# EAGLE design TDC1000_Front_End (EAGLE 9.3.0)
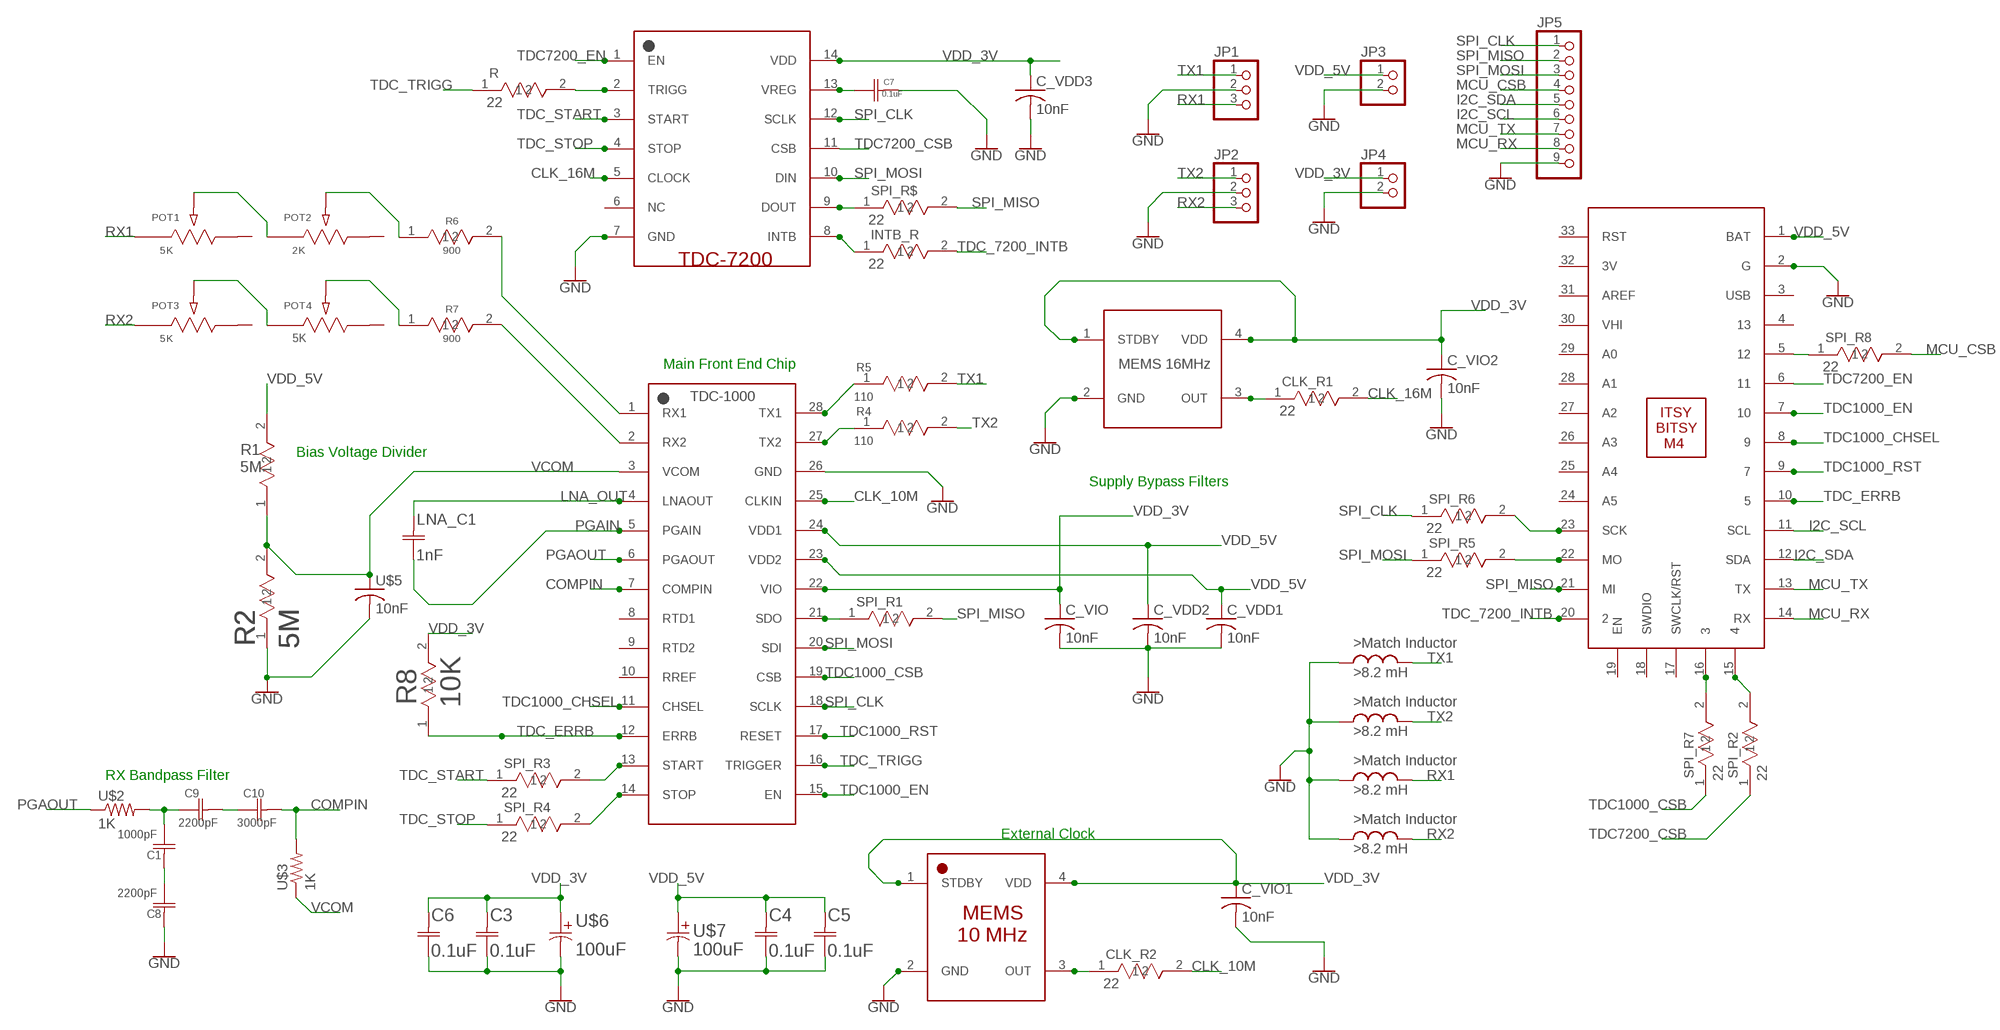
[diagram p0: schematic, sheet 1]

## Parts
C1  1000pF  06035C104JAT2A  [0603]
C3  0.1uF  06035C104JAT2A  [0603]
C4  0.1uF  06035C104JAT2A  [0603]
C5  0.1uF  06035C104JAT2A  [0603]
C6  0.1uF  06035C104JAT2A  [0603]
C7  0.1uF  06035C104JAT2A  [0603]
C8  2200pF  06035C104JAT2A  [0603]
C9  2200pF  06035C104JAT2A  [0603]
C10  3000pF  06035C104JAT2A  [0603]
C_VDD1  10nF  CL05B103KB5NNNC  [CL05B103KB5NNNC]
C_VDD2  10nF  CL05B103KB5NNNC  [CL05B103KB5NNNC]
C_VDD3  10nF  CL05B103KB5NNNC  [CL05B103KB5NNNC]
C_VIO  10nF  CL05B103KB5NNNC  [CL05B103KB5NNNC]
C_VIO1  10nF  CL05B103KB5NNNC  [CL05B103KB5NNNC]
C_VIO2  10nF  CL05B103KB5NNNC  [CL05B103KB5NNNC]
CLK_R1  22  MMB02070C2209FB200  [MMB0207]
CLK_R2  22  MMB02070C2209FB200  [MMB0207]
INTB_R  22  MMB02070C2209FB200  [MMB0207]
JP1  PINHD-1X3/90  [1X03/90]
JP2  PINHD-1X3/90  [1X03/90]
JP3  PINHD-1X2/90  [1X02/90]
JP4  PINHD-1X2/90  [1X02/90]
JP5  PINHD-1X9  [1X09]
LNA_C1  1nF  06035C104JAT2A  [0603]
POT1  5K  3362P-1-502LF  [POT_3362P]
POT2  2K  3362P-1-502LF  [POT_3362P]
POT3  5K  3362P-1-502LF  [POT_3362P]
POT4  5K  3362P-1-502LF  [POT_3362P]
R  22  MMB02070C2209FB200  [MMB0207]
R1  5M  PAT1206E9000BST1  [1206]
R2  5M  PAT1206E9000BST1  [1206]
R4  110  RR1220P-111-D  [RES_1220]
R5  110  RR1220P-111-D  [RES_1220]
R6  900  PAT1206E9000BST1  [1206]
R7  900  PAT1206E9000BST1  [1206]
R8  10K  RR0816P-103-D  [RES_0816]
SPI_R1  22  MMB02070C2209FB200  [MMB0207]
SPI_R2  22  MMB02070C2209FB200  [MMB0207]
SPI_R3  22  MMB02070C2209FB200  [MMB0207]
SPI_R4  22  MMB02070C2209FB200  [MMB0207]
SPI_R5  22  MMB02070C2209FB200  [MMB0207]
SPI_R6  22  MMB02070C2209FB200  [MMB0207]
SPI_R7  22  MMB02070C2209FB200  [MMB0207]
SPI_R8  22  MMB02070C2209FB200  [MMB0207]
SPI_R$  22  MMB02070C2209FB200  [MMB0207]
U$1  TDC1000_TSSOP  [TDC1000_TSSOP]
U$2  1K  ESR03_1K_RESISTOR  [ROHM_ESR03]
U$3  1K  ESR03_1K_RESISTOR  [ROHM_ESR03]
U$4  DSC1001CL5-010.0000_2.5X10MHZ_2.5X3.2MM  [DSC1001CL5-010.0000_2.5X3.2MM]
U$5  10nF  CL05B103KB5NNNC  [CL05B103KB5NNNC]
U$6  100uF  UKL1E101KPDANATA_100UF_CAP  [UKL1E101KPDANATA_100UF]
U$7  100uF  UKL1E101KPDANATA_100UF_CAP  [UKL1E101KPDANATA_100UF]
U$8  TDC7200_TSSOPTSSOP-14  [TDC7200_TSSOP]
U$9  DSC1001BL5-016.0000_5X3.2MM  [DSC1001BL5-016.0000_5X3.2MM]
U$10  ITSY_BITSY_M4  [ITSY_BITSY_M4]
U$11  AIUR_16_8.2MH_INDUCTOR  [AIUR-16_8MH_INDUCTOR]
U$12  AIUR_16_8.2MH_INDUCTOR  [AIUR-16_8MH_INDUCTOR]
U$13  AIUR_16_8.2MH_INDUCTOR  [AIUR-16_8MH_INDUCTOR]
U$14  AIUR_16_8.2MH_INDUCTOR  [AIUR-16_8MH_INDUCTOR]

## Nets
CLK_10M: CLK_R2.2 U$1.25(CLKIN)
CLK_16M: CLK_R1.2 U$8.5(CLOCK)
COMPIN: C10.2 U$1.7(COMPIN) U$3.P$2
GND: C3.1 C4.1 C5.1 C6.1 C7.2 C8.2 C_VDD1.2 C_VDD2.2 C_VDD3.2 C_VIO1.2 C_VIO2.2 C_VIO.2 JP1.2 JP2.2 JP3.2 JP4.2 JP5.9 R2.1 U$1.26(GND) U$4.2(GND) U$5.2 U$6.1 U$7.1 U$8.7(GND) U$9.2(GND) U$10.2(G) U$11.1 U$12.1 U$13.1 U$14.1
I2C_SCL: JP5.6 U$10.11(SCL)
I2C_SDA: JP5.5 U$10.12(SDA)
LNA_OUT: LNA_C1.2 U$1.4(LNAOUT)
MCU_CSB: JP5.4 SPI_R8.2
MCU_RX: JP5.8 U$10.14(RX)
MCU_TX: JP5.7 U$10.13(TX)
N$1: SPI_R1.1 U$1.21(SDO)
N$2: SPI_R2.2 U$10.15
N$3: R.2 U$8.2(TRIGG)
N$4: SPI_R3.2 U$1.13(START)
N$5: SPI_R8.1 U$10.5
N$6: CLK_R2.1 U$4.3(OUT)
N$8: C1.1 C9.1 U$2.P$2
N$9: R5.1 U$1.28(TX1)
N$10: C9.2 C10.1
N$11: R4.1 U$1.27(TX2)
N$12: SPI_R4.2 U$1.14(STOP)
N$13: SPI_R$.1 U$8.9(DOUT)
N$14: INTB_R.1 U$8.8(INTB)
N$15: SPI_R6.2 U$10.23(SCK)
N$16: SPI_R5.2 U$10.22(MO)
N$17: CLK_R1.1 U$9.3(OUT)
N$18: C7.1 U$8.13(VREG)
N$19: SPI_R7.2 U$10.16
N$20: POT4.2 R7.1
N$21: POT3.2 POT4.1
N$22: R7.2 U$1.2(RX2)
N$23: R6.2 U$1.1(RX1)
N$24: POT1.2 POT2.1
N$25: POT2.2 R6.1
N$26: C1.2 C8.1
PGAIN: LNA_C1.1 U$1.5(PGAIN)
PGAOUT: U$1.6(PGAOUT) U$2.P$1
RX1: JP1.3 POT1.1 U$14.2
RX2: JP2.3 POT3.1 U$13.2
SPI_CLK: JP5.1 SPI_R6.1 U$1.18(SCLK) U$8.12(SCLK)
SPI_MISO: JP5.2 SPI_R1.2 SPI_R$.2 U$10.21(MI)
SPI_MOSI: JP5.3 SPI_R5.1 U$1.20(SDI) U$8.10(DIN)
TDC1000_CHSEL: U$1.11(CHSEL) U$10.8
TDC1000_CSB: SPI_R7.1 U$1.19(CSB)
TDC1000_EN: U$1.15(EN) U$10.7
TDC1000_RST: U$1.17(RESET) U$10.9
TDC7200_CSB: SPI_R2.1 U$8.11(CSB)
TDC7200_EN: U$8.1(EN) U$10.6
TDC_7200_INTB: INTB_R.2 U$10.20
TDC_ERRB: R8.1 U$1.12(ERRB) U$10.10
TDC_START: SPI_R3.1 U$8.3(START)
TDC_STOP: SPI_R4.1 U$8.4(STOP)
TDC_TRIGG: R.1 U$1.16(TRIGGER)
TX1: JP1.1 R5.2 U$12.2
TX2: JP2.1 R4.2 U$11.2
VCOM: R1.1 R2.2 U$1.3(VCOM) U$3.P$1 U$5.1
VDD_3V: C3.2 C6.2 C_VDD3.1 C_VIO1.1 C_VIO2.1 C_VIO.1 JP4.1 R8.2 U$1.22(VIO) U$4.1(STDBY) U$4.4(VDD) U$6.2 U$8.14(VDD) U$9.1(STDBY) U$9.4(VDD)
VDD_5V: C4.2 C5.2 C_VDD1.1 C_VDD2.1 JP3.1 R1.2 U$1.23(VDD2) U$1.24(VDD1) U$7.2 U$10.1(BAT)
Unconnected: POT1.3 POT2.3 POT3.3 POT4.3 U$1.8(RTD1) U$1.9(RTD2) U$1.10(RREF) U$8.6(NC) U$10.3(USB) U$10.4 U$10.17(SWCLK/RST) U$10.18(SWDIO) U$10.19(EN) U$10.24(A5) U$10.25(A4) U$10.26(A3) U$10.27(A2) U$10.28(A1) U$10.29(A0) U$10.30(VHI) U$10.31(AREF) U$10.32(3V) U$10.33(RST)

## Notes on the sheet
- Main Front End Chip
- Bias Voltage Divider
- Supply Bypass Filters
- RX Bandpass Filter
- External Clock

## Library data of the parts
C1 C3-C10 LNA_C1 = Ultrasonic Misc PieceParts:06035C104JAT2A; MANUFACTURER_PART_NUMBER: 06035C104JAT2A; VENDOR: AVX Corporation
C_VDD1-C_VDD3 C_VIO C_VIO1 C_VIO2 U$5 = Ultrasonic Misc PieceParts:CL05B103KB5NNNC
CLK_R1 CLK_R2 INTB_R R SPI_R1-SPI_R8 SPI_R$ = Ultrasonic Misc PieceParts:MMB02070C2209FB200; MANUFACTURER_PART_NUMBER: MMB02070C2209FB200; VENDOR: Vishay
JP1 JP2 = pinhead:PINHD-1X3: PIN HEADER
JP3 JP4 = pinhead:PINHD-1X2: PIN HEADER
JP5 = pinhead:PINHD-1X9: PIN HEADER
POT1-POT4 = Ultrasonic Misc PieceParts:3362P-1-502LF; MANUFACTURER_PART_NUMBER: 3362P1502LF; VENDOR: Bourns Electronics
R1 R2 R6 R7 = Ultrasonic Misc PieceParts:PAT1206E9000BST1; MANUFACTURER_PART_NUMBER: PAT1206E9000BST1; VENDOR: Vishay
R4 R5 = Ultrasonic Misc PieceParts:RR1220P-111-D; MANUFACTURER_PART_NUMBER: RR1220P111D; VENDOR: Susumu
R8 = Ultrasonic Misc PieceParts:RR0816P-103-D; MANUFACTURER_PART_NUMBER: RR0816P103D; VENDOR: Susumu
U$1 = Texas Instruments:TDC1000_TSSOP
U$2 U$3 = Ultrasonic Misc PieceParts:ESR03_1K_RESISTOR
U$4 = MicroChip Technology:DSC1001CL5-010.0000_2.5X
U$6 U$7 = Ultrasonic Misc PieceParts:UKL1E101KPDANATA_100UF_CAP
U$8 = Texas Instruments:TDC7200_TSSOP
U$9 = MicroChip Technology:DSC1001BL5-016.0000_5X3.2MM: A 16MHz MEMS Oscillator (5x3.2mm) by MicroChip Technology
U$10 = Adafruit_Arduino:ITSY_BITSY_M4
U$11-U$14 = Ultrasonic Misc PieceParts:AIUR_16_8.2MH_INDUCTOR

## Board
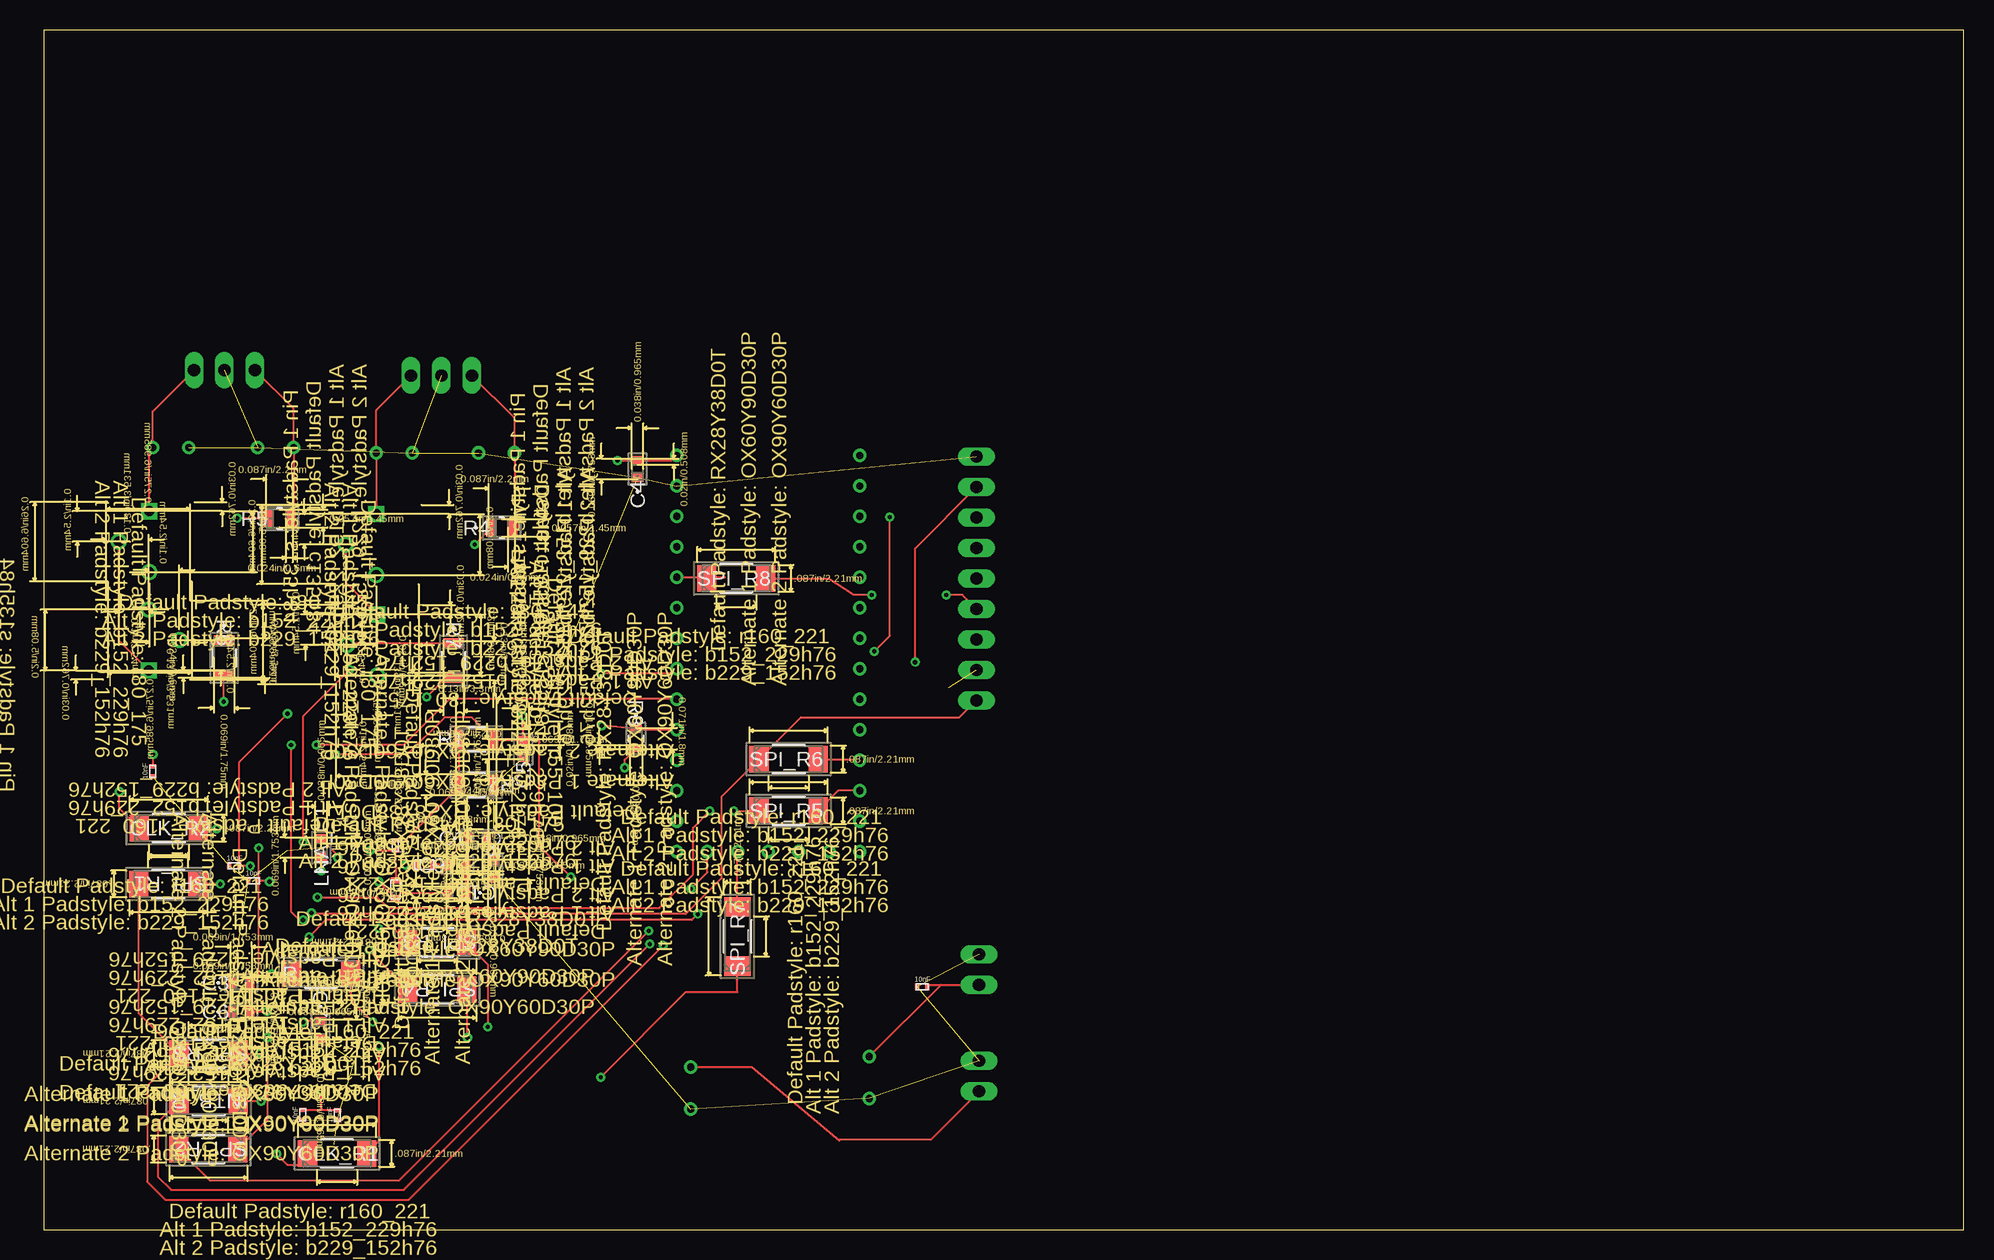
[diagram p1: board, top side]
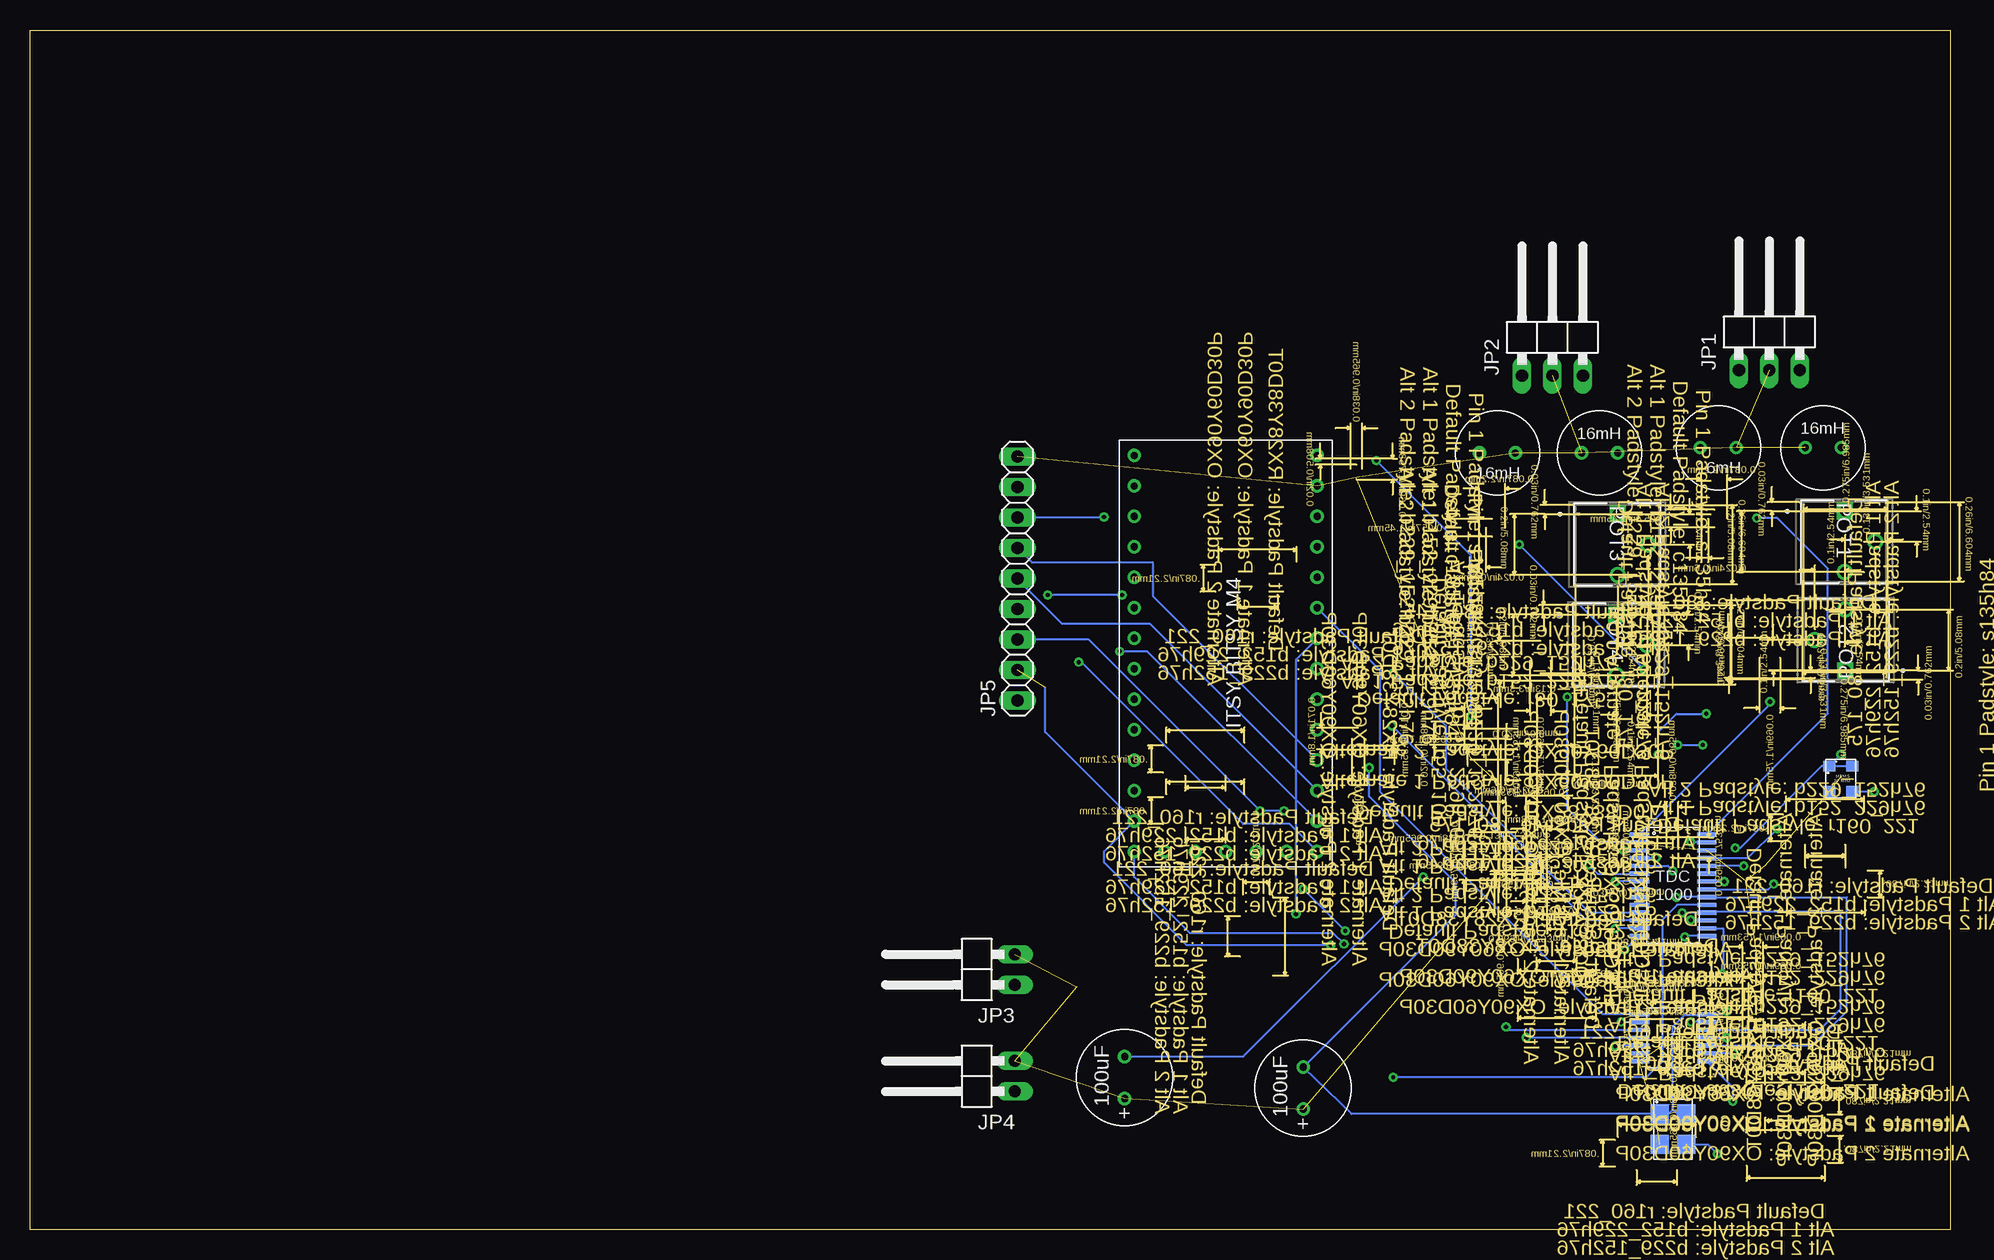
[diagram p2: board, bottom side, seen from below]

Size 160 x 100 mm. Coordinates in mm from the lower left corner, seen from the top.
Outline: 0,0 160,0 160,100 0,100 0,0
Copper layers (1*16): Top 0.035mm / dielectric 1.5mm / Bottom 0.035mm
Design rules "default": minimum track width 6mil, minimum drill 0.35mm, track to track 6mil, track to pad 6mil, pad to pad 6mil, via to via 6mil, smd to smd 6mil, copper to edge 40mil, drill to drill 6mil, minimum pad ring 10mil, minimum via ring 8mil, stop-mask expansion 4mil, vias tented up to drill 0mil, thermal gap 10mil

### Footprints (pad centres in the part's own frame; a part is rotated, then mirrored left to right if it is on the bottom)
0603 = smd 0.711 x 0.965: 1 -0.724,0; 2 0.724,0
CL05B103KB5NNNC = smd 0.33 x 0.6: 1 -0.415,0; 2 0.415,0
MMB0207 = smd 1.6 x 2.21: 1 -2.464,0; 2 2.464,0
1X03/90 = drill 1.016 long: 1 -2.54,-3.81; 2 0,-3.81; 3 2.54,-3.81
1X02/90 = drill 1.016 long: 1 -1.27,-3.81; 2 1.27,-3.81
1X09 = drill 1.016 long: 1 -10.16,0; 2 -7.62,0; 3 -5.08,0; 4 -2.54,0; 5 0,0; 6 2.54,0; 7 5.08,0; 8 7.62,0; 9 10.16,0
POT_3362P = drill 0.838 pad 1.346 square: 1 -5.08,0.076 | drill 0.838 pad 1.346: 2 -2.54,2.616; 3 0,0.076
1206 = smd 0.803 x 1.75: 1 -1.452,0; 2 1.452,0
RES_1220 = smd 0.803 x 1.45: 1 -0.902,0; 2 0.902,0
RES_0816 = smd 0.553 x 1: 1 -0.827,0; 2 0.827,0
TDC1000_TSSOP = smd 1.6 x 0.35: 1 -2.8,4.225; 2 -2.8,3.575; 3 -2.8,2.925; 4 -2.8,2.275; 5 -2.8,1.625; 6 -2.8,0.975; 7 -2.8,0.325; 8 -2.8,-0.325; 9 -2.8,-0.975; 10 -2.8,-1.625; 11 -2.8,-2.275; 12 -2.8,-2.925; 13 -2.8,-3.575; 14 -2.8,-4.225; 15 2.8,-4.225; 16 2.8,-3.575; 17 2.8,-2.925; 18 2.8,-2.275; 19 2.8,-1.625; 20 2.8,-0.975; 21 2.8,-0.325; 22 2.8,0.325; 23 2.8,0.975; 24 2.8,1.625; 25 2.8,2.275; 26 2.8,2.925; 27 2.8,3.575; 28 2.8,4.225
ROHM_ESR03 = smd 0.5 x 0.8: P$1 -0.75,0; P$2 0.75,0
DSC1001CL5-010.0000_2.5X3.2MM = smd 1 x 0.9: 1 -0.95,1.05; 2 -0.95,-1.05; 3 0.95,-1.05; 4 0.95,1.05
UKL1E101KPDANATA_100UF = drill 0.6: 1 -1.75,0; 2 1.75,0
TDC7200_TSSOP = smd 1.6 x 0.35: 1 -2.8,1.95; 2 -2.8,1.3; 3 -2.8,0.65; 4 -2.8,0; 5 -2.8,-0.65; 6 -2.8,-1.3; 7 -2.8,-1.95; 8 2.8,-1.95; 9 2.8,-1.3; 10 2.8,-0.65; 11 2.8,0; 12 2.8,0.65; 13 2.8,1.3; 14 2.8,1.95
DSC1001BL5-016.0000_5X3.2MM = smd 1.5 x 1.6: 1 -1.1,1.27; 2 -1.1,-1.27; 3 1.1,-1.27; 4 1.1,1.27
ITSY_BITSY_M4 = drill 0.6: 1 -16.51,7.62; 2 -13.97,7.62; 3 -11.43,7.62; 4 -8.89,7.62; 5 -6.35,7.62; 6 -3.81,7.62; 7 -1.27,7.62; 8 1.27,7.62; 9 3.81,7.62; 10 6.35,7.62; 11 8.89,7.62; 12 11.43,7.62; 13 13.97,7.62; 14 16.51,7.62; 15 16.51,5.08; 16 16.51,2.54; 17 16.51,0; 18 16.51,-2.54; 19 16.51,-5.08; 20 16.51,-7.62; 21 13.97,-7.62; 22 11.43,-7.62; 23 8.89,-7.62; 24 6.35,-7.62; 25 3.81,-7.62; 26 1.27,-7.62; 27 -1.27,-7.62; 28 -3.81,-7.62; 29 -6.35,-7.62; 30 -8.89,-7.62; 31 -11.43,-7.62; 32 -13.97,-7.62; 33 -16.51,-7.62
AIUR-16_8MH_INDUCTOR = drill 0.6: 1 -1.5,0; 2 1.5,0

### Placement (x,y rotation side)
C1  36.16,32.63 0 top
C3  16.44,20.56 0 top
C4  49.47,63.4 90 top
C5  39.95,40.05 90 top
C6  16.44,18.16 0 top
C7  23.05,16.66 270 top
C8  37.48,30 270 top
C9  34.45,30.37 0 top
C10  34.43,28.07 180 top
C_VDD1  73.18,20.24 180 top
C_VDD2  15.86,30.33 180 top
C_VDD3  21.58,9.57 270 top
C_VIO  9.07,38.19 270 top
C_VIO1  17.44,29.08 180 top
C_VIO2  24.46,9.53 270 top
CLK_R1  24.43,6.35 0 top
CLK_R2  10.41,33.47 0 top
INTB_R  13.73,10.71 180 top
JP1  15.05,75.45 0 bottom
JP2  33.13,75.01 0 bottom
JP3  81.74,21.67 90 bottom
JP4  81.74,12.78 90 bottom
JP5  77.71,54.27 90 bottom
LNA_C1  23.11,31.84 90 top
POT1  8.85,54.8 270 bottom
POT2  8.65,51.68 90 bottom
POT3  27.77,54.56 270 bottom
POT4  27.87,46.2 270 bottom
R  23.1,21.32 0 top
R1  36.03,40.88 0 top
R2  36.03,37.07 180 top
R4  38.16,58.5 0 top
R5  19.64,59.27 0 top
R6  15.02,47.65 270 top
R7  34.14,47.43 270 top
R8  49.34,40.93 270 top
SPI_R1  10.37,28.81 180 top
SPI_R2  13.7,6.7 180 top
SPI_R3  32.78,23.94 180 top
SPI_R4  32.78,20.02 180 top
SPI_R5  62.06,34.91 0 top
SPI_R6  62.06,39.22 0 top
SPI_R7  57.79,24.43 90 top
SPI_R8  57.7,54.29 0 top
SPI_R$  13.73,14.65 180 top
U$1  23.08,28.69 0 bottom
U$2  31.7,30.42 0 top
U$3  29.31,28.35 270 top
U$4  9.11,37.58 0 bottom
U$5  29.3,32.03 90 top
U$6  53.9,11.79 90 bottom
U$7  68.78,12.67 90 bottom
U$8  23.08,15.99 0 bottom
U$9  23.08,8.37 0 bottom
U$10  60.36,48.02 270 bottom
U$11  37.72,64.74 180 bottom
U$12  19.31,65.18 180 bottom
U$13  29.2,64.74 0 bottom
U$14  10.57,65.18 0 bottom

### Tracks (layer width: path | path; a pad name or v marks a point on that pad's centre or on a via)
CLK_10M  (via drill 0.35)
  Top 0.152: v14.4,33.4 14.33,33.47 CLK_R2.2
  Bottom 0.152: U$1.25 16.84,30.96 v14.4,33.4
CLK_16M  (via drill 0.35)
  Top 0.152: v27.9,15.3 27.9,7.36 CLK_R1.2
  Bottom 0.152: U$8.5 25.92,15.3 v27.9,15.3
COMPIN  (via drill 0.35)
  Top 0.152: C10.2 29.78,28.07 U$3.P$2 v27.91,29 v27.9,29
  Bottom 0.152: U$1.7 27.89,29.02 v27.9,29
GND  (29 unrouted)
I2C_SCL
  Bottom 0.152: U$10.11 66.4,52.79 66.4,55.6 76.5,55.6 JP5.6
I2C_SDA
  Bottom 0.152: U$10.12 66.65,50.5 74,50.5 77.71,54.21 JP5.5
LNA_OUT  (via drill 0.35)
  Top 0.152: LNA_C1.2 24.5,31.17 v24.5,31
  Bottom 0.152: U$1.4 24.54,30.96 v24.5,31
MCU_CSB  (via drill 0.35)
  Top 0.152: SPI_R8.2 65.38,54.29 67.47,52.9 v69,52.9 | JP5.4 76.54,52.9 v75.2,52.9
  Bottom 0.152: v69,52.9 v75.2,52.9
MCU_RX  (via drill 0.35)
  Top 0.152: v72.6,47.3 72.6,56.78 JP5.8
  Bottom 0.152: U$10.14 55.03,33.8 58.9,33.8 72.4,47.3 v72.6,47.3
MCU_TX  (via drill 0.35)
  Top 0.152: v69.2,48.2 70.5,49.5 v70.5,59.4
  Bottom 0.152: U$10.13 66.89,48.2 v69.2,48.2 | v70.5,59.4 70.55,59.35 JP5.7
N$1  (via drill 0.35)
  Top 0.152: v14.7,28.8 v14.69,28.81 SPI_R1.1
  Bottom 0.152: U$1.21 15.13,28.36 v14.7,28.8
N$2  (via drill 0.35)
  Top 0.152: SPI_R2.2 13.84,4.1 29.6,4.1 v50.4,24.9 | v53.9,28.4 55.28,29.78 U$10.15
  Bottom 0.152: v50.4,24.9 v53.9,28.4
N$3  (via drill 0.35)
  Top 0.152: R.2 25.56,19.14 v27.4,17.3
  Bottom 0.152: v27.4,17.3 U$8.2
N$4  (via drill 0.35)
  Top 0.152: SPI_R3.2 29.16,25.1 v27.9,25.1
  Bottom 0.152: U$1.13 27.89,25.11 v27.9,25.1
N$5
  Top 0.152: 53.15,54.37 U$10.5 56.74,54.37 SPI_R8.1
N$6  (via drill 0.35)
  Top 0.152: CLK_R2.1 6.3,35.12 v6.3,36.5
  Bottom 0.152: v6.3,36.5 8.13,36.5 U$4.3
N$8
  Top 0.152: C1.1 33.73,30.92 C9.1 33.68,30.42 U$2.P$2
N$9  (via drill 0.35)
  Top 0.152: v16.1,59.3 18.71,59.3 R5.1
  Bottom 0.152: U$1.28 10.18,43.02 10.18,55.1 14.38,59.3 v16.1,59.3
N$10
  Top 0.152: C9.2 35.17,28.09 C10.1
N$11  (via drill 0.35)
  Top 0.152: v21.6,32.3 21.6,42.8 v25.5,46.7 | v35.9,57.1 37.26,58.46 R4.1
  Bottom 0.152: U$1.27 21.57,32.27 v21.6,32.3 | v25.5,46.7 v35.9,57.1
N$12  (via drill 0.35)
  Top 0.152: SPI_R4.2 27.1,23.24 v27.1,23.3
  Bottom 0.152: v27.1,23.3 25.93,24.46 U$1.14
N$13  (via drill 0.35)
  Top 0.152: SPI_R$.1 17.95,14.65 v18,14.7
  Bottom 0.152: v18,14.7 U$8.9
N$14  (via drill 0.35)
  Top 0.152: INTB_R.1 v18.09,10.71 v18.1,10.7
  Bottom 0.152: U$8.8 18.1,11.86 v18.1,10.7
N$15
  Top 0.152: 65.03,39.22 SPI_R6.2 64.61,39.13 U$10.23
N$16
  Top 0.152: U$10.22 66.2,36.59 SPI_R5.2
N$17  (via drill 0.35)  (1 unrouted)
  Top 0.152: v19.4,6.3 20.3,5.4 21.5,5.4
  Bottom 0.152: U$9.3 20.2,7.1 v19.4,6.3
N$18  (via drill 0.35)
  Top 0.152: C7.1 21.68,17.38 v21.6,17.3
  Bottom 0.152: U$8.13 v21.6,17.3
N$19
  Top 0.152: SPI_R7.2 57.79,31.48 U$10.16
N$20
  Top 0.152: POT4.2 25.39,48.88 R7.1
N$21
  Top 0.152: POT3.2 25.15,53.92 POT4.1
N$22  (via drill 0.35)
  Top 0.152: v31.9,44.4 33.48,45.98 R7.2
  Bottom 0.152: U$1.2 28.93,32.27 29,32.2 31.9,35.1 v31.9,44.4
N$23  (via drill 0.35)
  Top 0.152: v15,44 15,46.18 R6.2
  Bottom 0.152: U$1.1 15,43.8 v15,44
N$24
  Top 0.152: POT2.1 6.23,49.09 POT1.2
N$25
  Top 0.152: R6.1 11.3,49.1 POT2.2
N$26
  Top 0.152: C8.1 37.48,32.04 C1.2
PGAIN  (via drill 0.35)
  Top 0.152: v23.1,29.9 23.1,31.11 LNA_C1.1
  Bottom 0.152: U$1.5 23.52,30.32 v23.1,29.9
PGAOUT  (via drill 0.35)
  Top 0.152: U$2.P$1 30.93,30.4 v30.1,30.4
  Bottom 0.152: v30.1,30.4 29.36,29.66 U$1.6
RX1
  Top 0.152: POT1.1 8.77,64.88 U$14.2 9.07,68.2 JP1.3
RX2
  Top 0.152: JP2.3 27.7,68.31 U$13.2 POT3.1
SPI_CLK  (via drill 0.35)
  Top 0.152: v22.3,26.4 22.4,26.3 53.5,26.3 56.5,29.3 56.5,36.12 SPI_R6.1 63.08,42.7 76.3,42.7 JP5.1
  Bottom 0.152: U$8.12 10.86,16.64 9.1,18.4 9.1,26.4 9.2,26.5 20.2,26.5 U$1.18 | U$1.18 20.3,26.4 | U$1.18 22.29,26.41 v22.3,26.4
SPI_MISO  (via drill 0.35)  (1 unrouted)
  Top 0.152: SPI_R1.2 7.91,18.01 SPI_R$.2 8.6,11.98 8.6,4 10.1,2.5 30.4,2.5 v51.6,23.7
  Bottom 0.152: v51.6,23.7 63.6,23.7 70.5,30.6 70.5,31.53 U$10.21 75.4,41.47 75.4,45.2
SPI_MOSI  (via drill 0.35)
  Top 0.152: v22.8,27.7 27.8,27.7 28.7,26.8 51.3,26.8 54.1,29.6 54.1,33.5 v55.5,34.9 | v57.5,34.9 59.59,34.9 SPI_R5.1
  Bottom 0.152: U$8.10 11.46,15.34 8.6,18.2 8.6,27.7 20.27,27.7 U$1.20 22.79,27.71 v22.8,27.7 | v55.5,34.9 v57.5,34.9 71.79,49.19 JP5.3
TDC1000_CHSEL  (via drill 0.35)
  Top 0.152: v46.4,46.4 52.39,46.4 U$10.8
  Bottom 0.152: U$1.11 30.02,26.41 42,38.4 42,42 v46.4,46.4
TDC1000_CSB  (via drill 0.35)
  Top 0.152: v46.4,12.7 53.5,19.8 57.8,19.8 57.8,21.96 SPI_R7.1
  Bottom 0.152: U$1.19 22.73,27.07 24,25.8 24,14 25.3,12.7 v46.4,12.7
TDC1000_EN  (via drill 0.35)
  Top 0.152: v22.1,24.4 23.5,25.8 54,25.8 v54.5,26.3
  Bottom 0.152: U$1.15 22.04,24.46 v22.1,24.4 | v54.5,26.3 54.5,47.53 U$10.7
TDC1000_RST  (via drill 0.35)
  Top 0.152: U$10.9 33.81,44.21 30,40.4 v22.7,40.4 | v21.6,25.8 21.3,25.8 20.6,26.5 v20.6,40.4
  Bottom 0.152: v22.7,40.4 v20.6,40.4 | U$1.17 21.57,25.77 v21.6,25.8
TDC7200_CSB  (via drill 0.35)
  Top 0.152: v18.6,16 18.6,9.14 SPI_R2.1
  Bottom 0.152: U$8.11 v18.61,15.99 v18.6,16
TDC7200_EN
  Bottom 0.152: U$8.1 28.94,17.94 47.5,36.5 47.5,46.59 U$10.6
TDC_7200_INTB  (via drill 0.35)
  Top 0.152: INTB_R.2 9.5,8.94 9.5,4.4 10.6,3.3 30,3.3 v50.5,23.8
  Bottom 0.152: v50.5,23.8 51.4,24.7 63.3,24.7 67.98,29.38 U$10.20
TDC_ERRB  (via drill 0.35)
  Top 0.152: U$10.10 49.53,41.67 R8.1 46.54,42.04 v46.5,42
  Bottom 0.152: U$1.12 30.27,25.77 v46.5,42
TDC_START  (via drill 0.35)
  Top 0.152: SPI_R3.1 35.24,23.84 37,22.08 v37,16.9
  Bottom 0.152: U$8.3 36.96,16.64 37,16.68 v37,16.9
TDC_STOP  (via drill 0.35)
  Top 0.152: SPI_R4.1 35.24,16.06 v35.3,16
  Bottom 0.152: U$8.4 v35.29,15.99 v35.3,16
TDC_TRIGG  (via drill 0.35)
  Top 0.152: v19,21.3 19.02,21.32 R.1
  Bottom 0.152: U$1.16 18.91,25.11 18.9,25.1 18.9,21.4 v19,21.3
TX1
  Top 0.152: JP1.1 20.81,68.42 U$12.2 20.81,59.54 R5.2
TX2
  Top 0.152: R4.2 39.22,58.66 U$11.2 39.22,67.65 JP2.1
VCOM  (via drill 0.35)
  Top 0.152: U$5.1 U$3.P$1 | v27.2,31.6 29.29,31.6 U$5.1 | R1.1 R2.2 34.58,36.89 U$5.1
  Bottom 0.152: U$1.3 27.18,31.61 v27.2,31.6
VDD_3V  (via drill 0.35)
  Top 0.152: v9.1,39.6 9.07,39.57 C_VIO.1 | JP4.1 73.92,7.5 66.2,7.5 66.3,7.4 59,13.54 U$6.2 | C_VDD3.1 23.1,9.98 | 23.1,9.98 24.42,9.98 C_VIO2.1 | 23.1,9.98 v23.1,11.6 | v17.9,31.8 17.85,31.75 C_VIO1.1 | v18.8,29 18.72,29.08 C_VIO1.1 | C_VIO1.1 17.85,21.25 C3.2 C6.2 17.2,18.2 v18.6,18.2 | v48.4,38.5 48.4,39.16 R8.2
  Bottom 0.152: U$4.1 U$4.4 | U$4.1 v9.1,39.59 v9.1,39.6 | 23.1,10 v23.1,11.6 23.1,16.9 22.1,17.9 20.32,17.9 U$8.14 18.86,17.94 v18.6,18.2 | 23.1,10 23.46,9.64 U$9.1 49.86,9.64 U$6.2 41.2,26.24 41.2,28.9 48.4,36.1 v48.4,38.5 | U$9.4 22.74,9.64 23.1,10 | U$4.1 10.67,38.63 17.5,31.8 v17.9,31.8 | U$1.22 18.82,29.02 v18.8,29
VDD_5V  (via drill 0.35)
  Top 0.152: U$7.2 74.76,20.4 | 74.76,20.4 73.75,20.4 C_VDD1.1 | 74.76,20.4 JP3.1 | U$10.1 52.33,64.12 C4.2 47.82,64.12 v47.8,64.1 | 39.7,40.77 C5.2 39.95,42.75 v39.9,42.8 | 39.7,40.77 37.59,40.77 R1.2 35.66,42.7 33.4,42.7 30.3,39.6 v24.3,39.6 | v17.2,30.3 16.3,30.3 C_VDD2.1 16.27,38.97 v20.3,43 | v43.9,29.4 41.3,32 41.3,40.8 39.73,40.8 39.7,40.77
  Bottom 0.152: v17.2,30.3 20.27,30.3 U$1.24 U$1.23 | v24.3,39.6 24.3,41.5 22.8,43 v20.3,43 | U$7.2 58.88,14.42 v43.9,29.4 | v39.9,42.8 39.9,56.2 v47.8,64.1